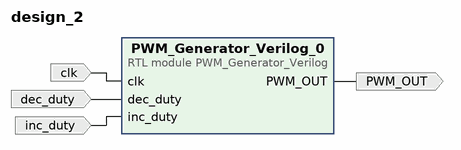
[diagram p0: block diagram of the top level]
# Vivado block design design_2, xc7a35tcpg236-1, Vivado 2021.1
create_bd_design design_2

create_bd_port -dir I -type clk clk
set_property -dict {CONFIG.FREQ_HZ 100000000} [get_bd_ports clk]
create_bd_port -dir I inc_duty
create_bd_port -dir I dec_duty
create_bd_port -dir O PWM_OUT

create_bd_cell -type module -reference PWM_Generator_Verilog PWM_Generator_Verilog_0

# ---- connections ----

connect_bd_net [get_bd_pins PWM_Generator_Verilog_0/PWM_OUT] [get_bd_ports PWM_OUT]
connect_bd_net [get_bd_ports clk] [get_bd_pins PWM_Generator_Verilog_0/clk]
connect_bd_net [get_bd_ports dec_duty] [get_bd_pins PWM_Generator_Verilog_0/dec_duty]
connect_bd_net [get_bd_ports inc_duty] [get_bd_pins PWM_Generator_Verilog_0/inc_duty]

validate_bd_design
save_bd_design
